# Altium schematic sheet s1_sensor.SchDoc
size A4; SheetNumber: 1; SheetTotal: 1
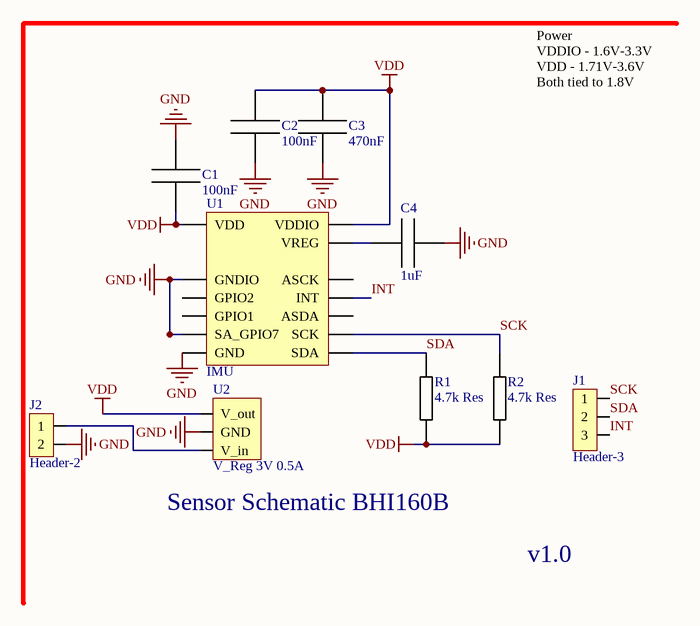
[diagram p0: s1_sensor.SchDoc]

## Parts
C1  100nF  [0805 Passive]
C2  100nF  [0805 Passive]
C3  470nF  [0805 Passive]
C4  1uF  [0805 Passive]
J1  Header-3  [Header-3]
J2  Header-2  [Header-2]
R1  4.7k Res  [0805 Passive]
R2  4.7k Res  [0805 Passive]
U1  IMU  [BHI160b]
U2  V_Reg 3V 0.5A  [Header-3]

## Nets
GND: C1.1 C2.0 C3.0 C4.1 J2.2 U1.9(SA_GPIO7) U1.18(GND) U1.20(GNDIO) U2.2(GND)
VDD: C1.0 C2.1 C3.1 R1.2 R2.1 U1.8(VDDIO) U1.13(VDD) U2.3(V_out)
INT: J1.3 U1.12(INT)
SCK: J1.1 R2.2 U1.22(SCK)
SDA: J1.2 R1.1 U1.24(SDA)
NetC4_0: C4.0 U1.10(VREG)
NetJ2_1: J2.1 U2.1(V_in)

Not connected (* = marked no-connect by the designer): U1 3(GPIO1) 7(ASCK) 11(GPIO2) 21(ASDA)

## Notes on the sheet
- Power
  VDDIO - 1.6V-3.3V
  VDD - 1.71V-3.6V
  Both tied to 1.8V
- (near U2) Sensor Schematic BHI160B
- v1.0

## Library data of the parts
J1 = Header 3-pin
J2 = Header 2-pin
U1 = BHI160B
U2 = V_Reg